# Altium schematic sheet current_sense.SchDoc
size A3; SheetNumber: 3; SheetTotal: 4
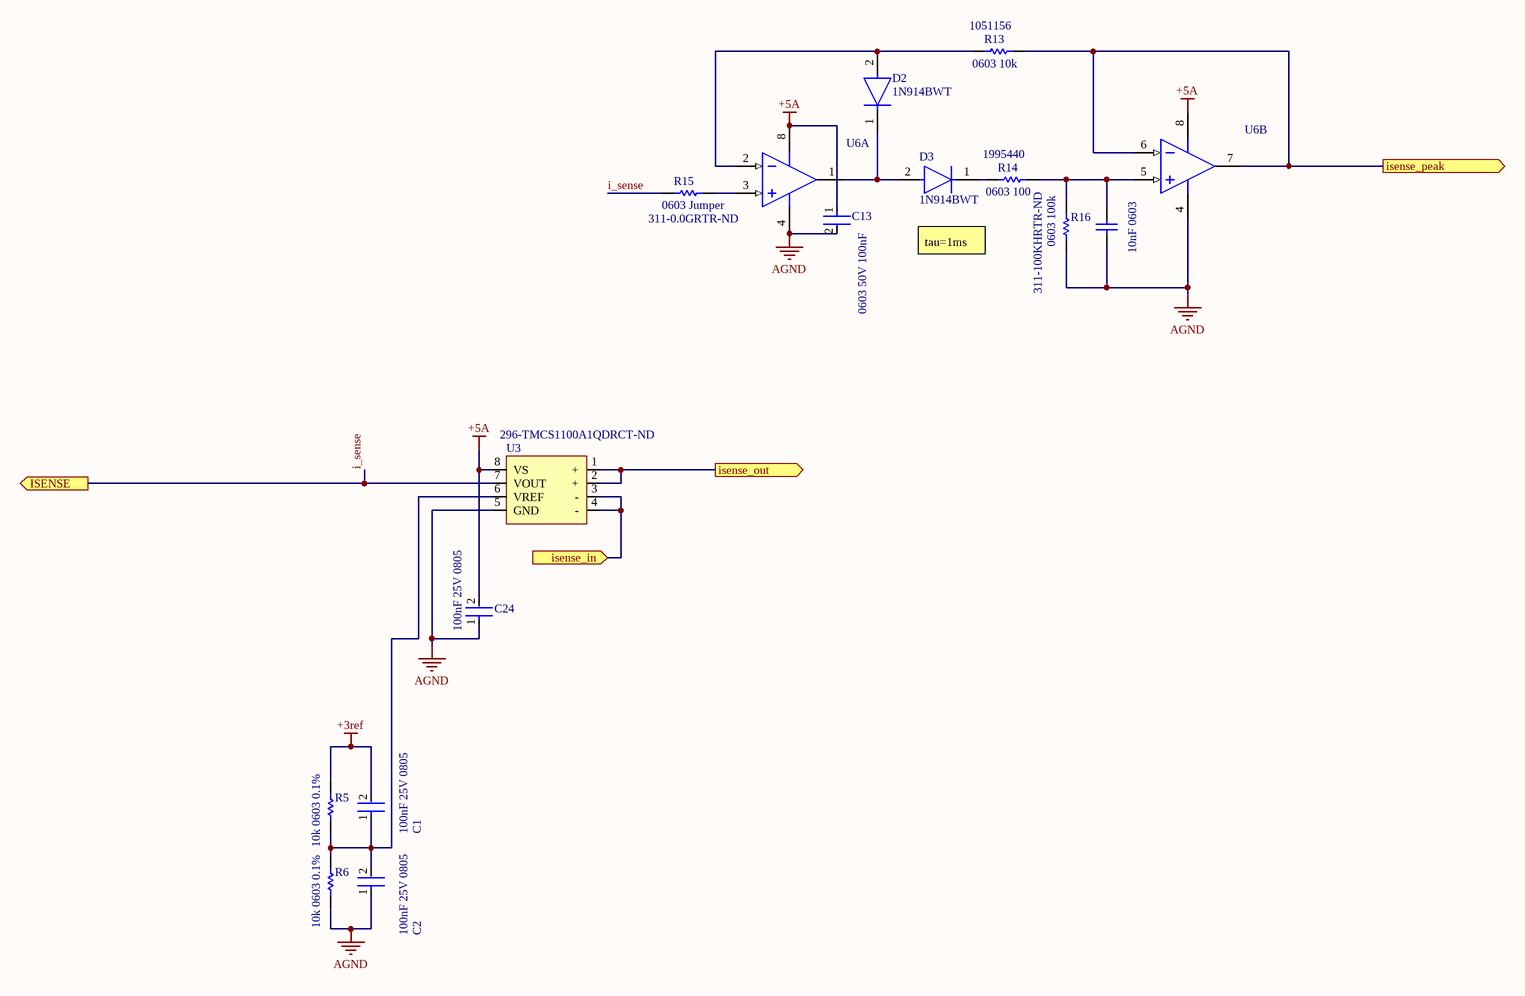
[diagram p0: current_sense.SchDoc]

## Parts
10nF_0603  06035C-103KAT2A  [CAPC1608X90X35LL15T15]  (value not drawn)
C1  100nF 25V 0805  [FP-CC0805-0_85-MFG]
C2  100nF 25V 0805  [FP-CC0805-0_85-MFG]
C13  0603 50V 100nF  [FP-CGA3E-0_3-0_1-IPC_A]
C24  100nF 25V 0805  [FP-CC0805-0_85-MFG]
D2  1N914BWT  [FP-502-01-MFG]
D3  1N914BWT  [FP-502-01-MFG]
R5  10k 0603 0.1%  [RESC1608X55X30ML20T20]
R6  10k 0603 0.1%  [RESC1608X55X30ML20T20]
R13  0603 10k  Supplier Part Number 1: 1051156  [RES 0603_1608]
R14  0603 100  Supplier Part Number 1: 1995440  [RES 0603_1608]
R15  0603 Jumper  Supplier Part Number 1: 311-0.0GRTR-ND  [RES 0603_1608]
R16  0603 100k  Supplier Part Number 1: 311-100KHRTR-ND  [RES 0603_1608]
U3  Supplier Part Number 1: 296-TMCS1100A1QDRCT-ND  [SOIC8]  (hidden comment: TMCS1100A1QDR)
U6  LTC6244HMS8#TRPBF  [LT-MS8-8_L]  (value not drawn)  (parts A,B of 2)

## Ports
ISENSE (out), isense_in (in), isense_out (out), isense_peak (out)

## Nets
+3ref: C1.2 R5.2
+5A: C13.1 C24.2 U3.8(VS) U6.8(V+)
AGND: 10nF_0603.1 C2.1 C13.2 C24.1 R6.1 R16.1 U3.5(GND) U6.4(V-)
i_sense: R15.1 U3.7(VOUT) ; port ISENSE
isense_in: U3.3(-) U3.4(-) ; port isense_in
isense_out: U3.1(+) U3.2(+) ; port isense_out
isense_peak: R13.2 U6.6(IN-_B) U6.7(OUT_B) ; port isense_peak
Net10nF_0603_2: 10nF_0603.2 R14.2 R16.2 U6.5(IN+_B)
NetC1_1: C1.1 C2.2 R5.1 R6.2 U3.6(VREF)
NetD2_1: D2.1(C) D3.2(A) U6.1(OUT_A)
NetD2_2: D2.2(A) R13.1 U6.2(IN-_A)
NetD3_1: D3.1(C) R14.1
NetR15_2: R15.2 U6.3(IN+_A)

## Notes on the sheet
- tau=1ms
- 1
- 2
- 3
- 4
- 5
- 6
- 7
- 8
- A
- B
- C
- D
- Project:
- Date:
- Drawing number:
- Rev:
- Format:
- A3
- Drawn by:
- Laboratory:
- Page
- Sheet:
- of
- File:

## Library data of the parts
10nF_0603 = CMP-2006-04374-1: Manufacturer: AVX Interconnect / Elco; Part Number: 06035C-103KAT2A
C1 C2 C24 = CMP-1036-04410-2: CAP CER 0.1UF 25V X7R 0805; Manufacturer Part Number: CC0805KRX7R8BB104; Manufacturer: Yageo; Tolerance: 0.1; Material: Ceramic; ComponentLink2URL: http://www.yageo.com/documents/recent/UPY-GPHC_Y5V_6.3V-to-50V_8.pdf; Category: Cap; Mouser Description: Multilayer Ceramic Capacitors MLCC - SMD/SMT 100nF 25V X7R 10%; Device Class L1: Passive Components; Footprint Url: http://www.yageo.com/exep/pages/download/literatures/UPY-C_GEN_24.pdf; Height: 0.95mm; Digikey Description: CAP CER 0.1UF 25V X7R 0805; Lead Free: Yes; Temperature Range High: +85°C; Temperature: -30°C to +85°C; Ipc Land Pattern Name: CAPC200125X85; Value: 100 nF; Capacitance: 100 nF; Automotive: No; Octopart: https://octopart.com/cc0805krx7r8bb104-yageo-39467766; Device Class L2: Capacitors; Temperature Characteristic: X7R; Voltage Rating: 25 V; ComponentLink2Description: Datasheet; Temperature Range Low: -30°C; Device Class L3: Ceramic Capacitors; RoHS: TRUE; Package: CC0805-0.85
C13 = CMP-2000-07546-2: Cap Ceramic 100nF 50V X7R 10% Pad SMD 0603 +125°C Automotive T/R / CGA3E2X7R1H104K080AA; Weight: 7.1E-05oz; Composition: Ceramic; Max Operating Temperature: 125°C; Termination: SMD/SMT; Dielectric: X7R; Length: 1.6mm; Package Quantity: 1; REACH SVHC: No SVHC; Lead Free: Lead Free; Case Code (Metric): 1608; Min Operating Temperature: -55°C; Packaging: Tape and Reel; Tolerance: 10%; Voltage Rating: 50V; Case Code (Imperial): 0603; Capacitance: 100nF; Case/Package: 0603; Voltage Rating (DC): 50V; Depth: 0.8mm; Radiation Hardening: No; Ratings: AEC-Q200; Mount: Surface Mount; Voltage: 50V; Thickness: 0.035inch; Width: 0.8mm; Height: 0.8mm
D2 D3 = CMP-07163-000008-1: DIODE GEN PURP 75V 200MA SOD523F; Manufacturer: ON Semiconductor; Forward Current: 300mA; Capacitance: 4pF; Max Junction Temp: +150°C; Reverse Voltage: 100V; Value: 4pF; Peak Reverse Current: 5uA; ComponentLink2Description: Datasheet; Package: 502-01; Manufacturer Part Number: 1N914BWT; Digikey Description: DIODE GEN PURP 75V 200MA SOD523F; Temperature Range High: +150°C; Temperature: -55°C to +150°C; Footprint Url: https://www.onsemi.com/pub/Collateral/502-01.PDF; Device Class L2: Diodes; Lead Free: Yes; Automotive: No; Category: Diode; Octopart: https://octopart.com/1n914bwt-on+semiconductor-84323166; Device Class L1: Discrete Semiconductors; Ipc Land Pattern Name: SODFL16080X60; Device Class L3: Rectifier Diodes; Height: 0.7mm; Max Repetitive Reverse Voltage: 75V; Mouser Description: Diodes - General Purpose, Power, Switching SINGLE JUNC. 100V 4.0NS COMP; Temperature Range Low: -55°C; ComponentLink2URL: https://www.onsemi.com/pub/Collateral/1N914BWT-D.pdf; RoHS: TRUE
R5 R6 = CMP-2000-00874-1: ERA-3AEB103V; Manufacturer: Panasonic; Part Number: ERA-3AEB103V
R13-R16 = Res1: Resistor; Value: 1K; Published: 8-Jun-2000; LatestRevisionDate: 17-Jul-2002; LatestRevisionNote: Re-released for DXP Platform.; PackageReference: AXIAL-0.3; Publisher: Altium Limited; PackageDescription: Axial Device, Thru-Hole; 2 Leads; 0.3 in Pin Spacing
  R13 R14: Supplier 1: RSComponents
  R15 R16: Supplier 1: Digi-Key
U3 = TMCS1100A1QDR: TMCS1100A1QDR / 50mV/A , 1.8mOhm , 3V-5.5V; Supplier 1: Digi-Key
U6 = CMP-0359-00848-2: Dual Channel, Low Noise, CMOS Operational Amplifier, RRO, 50 MHz Typical GBW, 35 V/us Typical SR, 2.8 to 6 V, 8-Pin SOP (MS8-8), High Temperature / Automotive, Pb-Free, Reel; Manufacturer: Linear Technology; Channels (#): 2; Is (mA) Typical: 6.25; Vos (mV) Typical: 0.04; GBW (MHz) Typical: 50; SR (V/us) Typical: 35; Vs Max (V): 6; Vs Min (V): 2.8; RoHS: Pb-Free; ComponentLink3Description: Package Specification; ComponentLink1URL: http://www.linear.com/; ComponentLink3URL: http://cds.linear.com/docs/en/packaging/05081610_G_SO8.pdf; Linear Technology Part Number: LTC6244; ComponentLink1Description: Manufacturer URL; PartNumber: LTC6244HMS8#TRPBF; Packing: Reel; ComponentLink2URL: http://cds.linear.com/docs/en/datasheet/6244fb.pdf; PackageVersion: Rev G; Mounting Technology: Surface Mount; ComponentLink2Description: Datasheet; DatasheetVersion: Rev. B; Type: VFB; PackageDescription: 8-Lead Plastic Small Outline, Body 3.9 x 4.9 mm, Pitch 1.27 mm; RevisionNote: URLs updated; PackageReference: LT-MS8-8